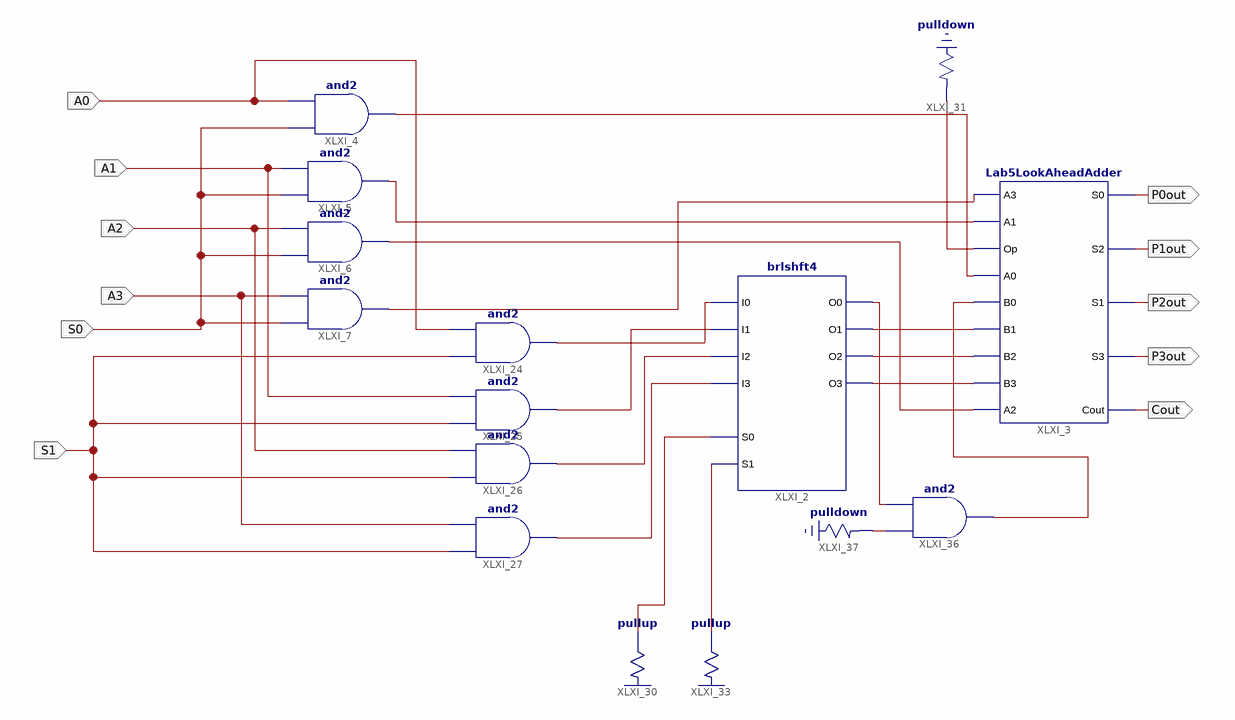
[diagram p0: schematic sheet 1]
// Xilinx ISE schematic Lab5Exp5.sch (spartan3e) as structural Verilog: 15 symbols, 11 ports
module Lab5Exp5 (
  input  A1,
  input  A2,
  input  A3,
  input  S0,
  input  S1,
  input  A0,
  output P0out,
  output P1out,
  output P2out,
  output P3out,
  output Cout
);

  wire XLXN_2, XLXN_3, XLXN_28, XLXN_29, XLXN_31, XLXN_42, XLXN_43, XLXN_45, XLXN_47, XLXN_48, XLXN_49,
       XLXN_50, XLXN_66, XLXN_67, XLXN_68, XLXN_71, XLXN_74;

  Lab5LookAheadAdder XLXI_3 (
    .A3(XLXN_49), .A1(XLXN_47), .Op(XLXN_50), .A0(XLXN_45), .B0(XLXN_68), .B1(XLXN_2), .B2(XLXN_3),
    .B3(XLXN_67), .A2(XLXN_48), .S0(P0out), .S2(P1out), .S1(P2out), .S3(P3out), .Cout(Cout));
  and XLXI_4 (XLXN_45, S0, A0);
  and XLXI_5 (XLXN_47, S0, A1);
  and XLXI_6 (XLXN_48, S0, A2);
  and XLXI_24 (XLXN_28, S1, A0);
  and XLXI_25 (XLXN_74, S1, A1);
  and XLXI_26 (XLXN_29, S1, A2);
  and XLXI_27 (XLXN_31, S1, A3);
  \pullup  XLXI_30 (.O(XLXN_43));
  \pulldown  XLXI_31 (.O(XLXN_50));
  brlshft4 XLXI_2 (
    .I0(XLXN_74), .I1(XLXN_28), .I2(XLXN_29), .I3(XLXN_31), .S0(XLXN_43), .S1(XLXN_42), .O0(XLXN_71),
    .O1(XLXN_2), .O2(XLXN_3), .O3(XLXN_67));
  \pullup  XLXI_33 (.O(XLXN_42));
  and XLXI_36 (XLXN_68, XLXN_66, XLXN_71);
  \pulldown  XLXI_37 (.O(XLXN_66));
  and XLXI_7 (XLXN_49, S0, A3);
endmodule
